# EAGLE design pico32_remote_v1_0 (EAGLE 9.6.2)
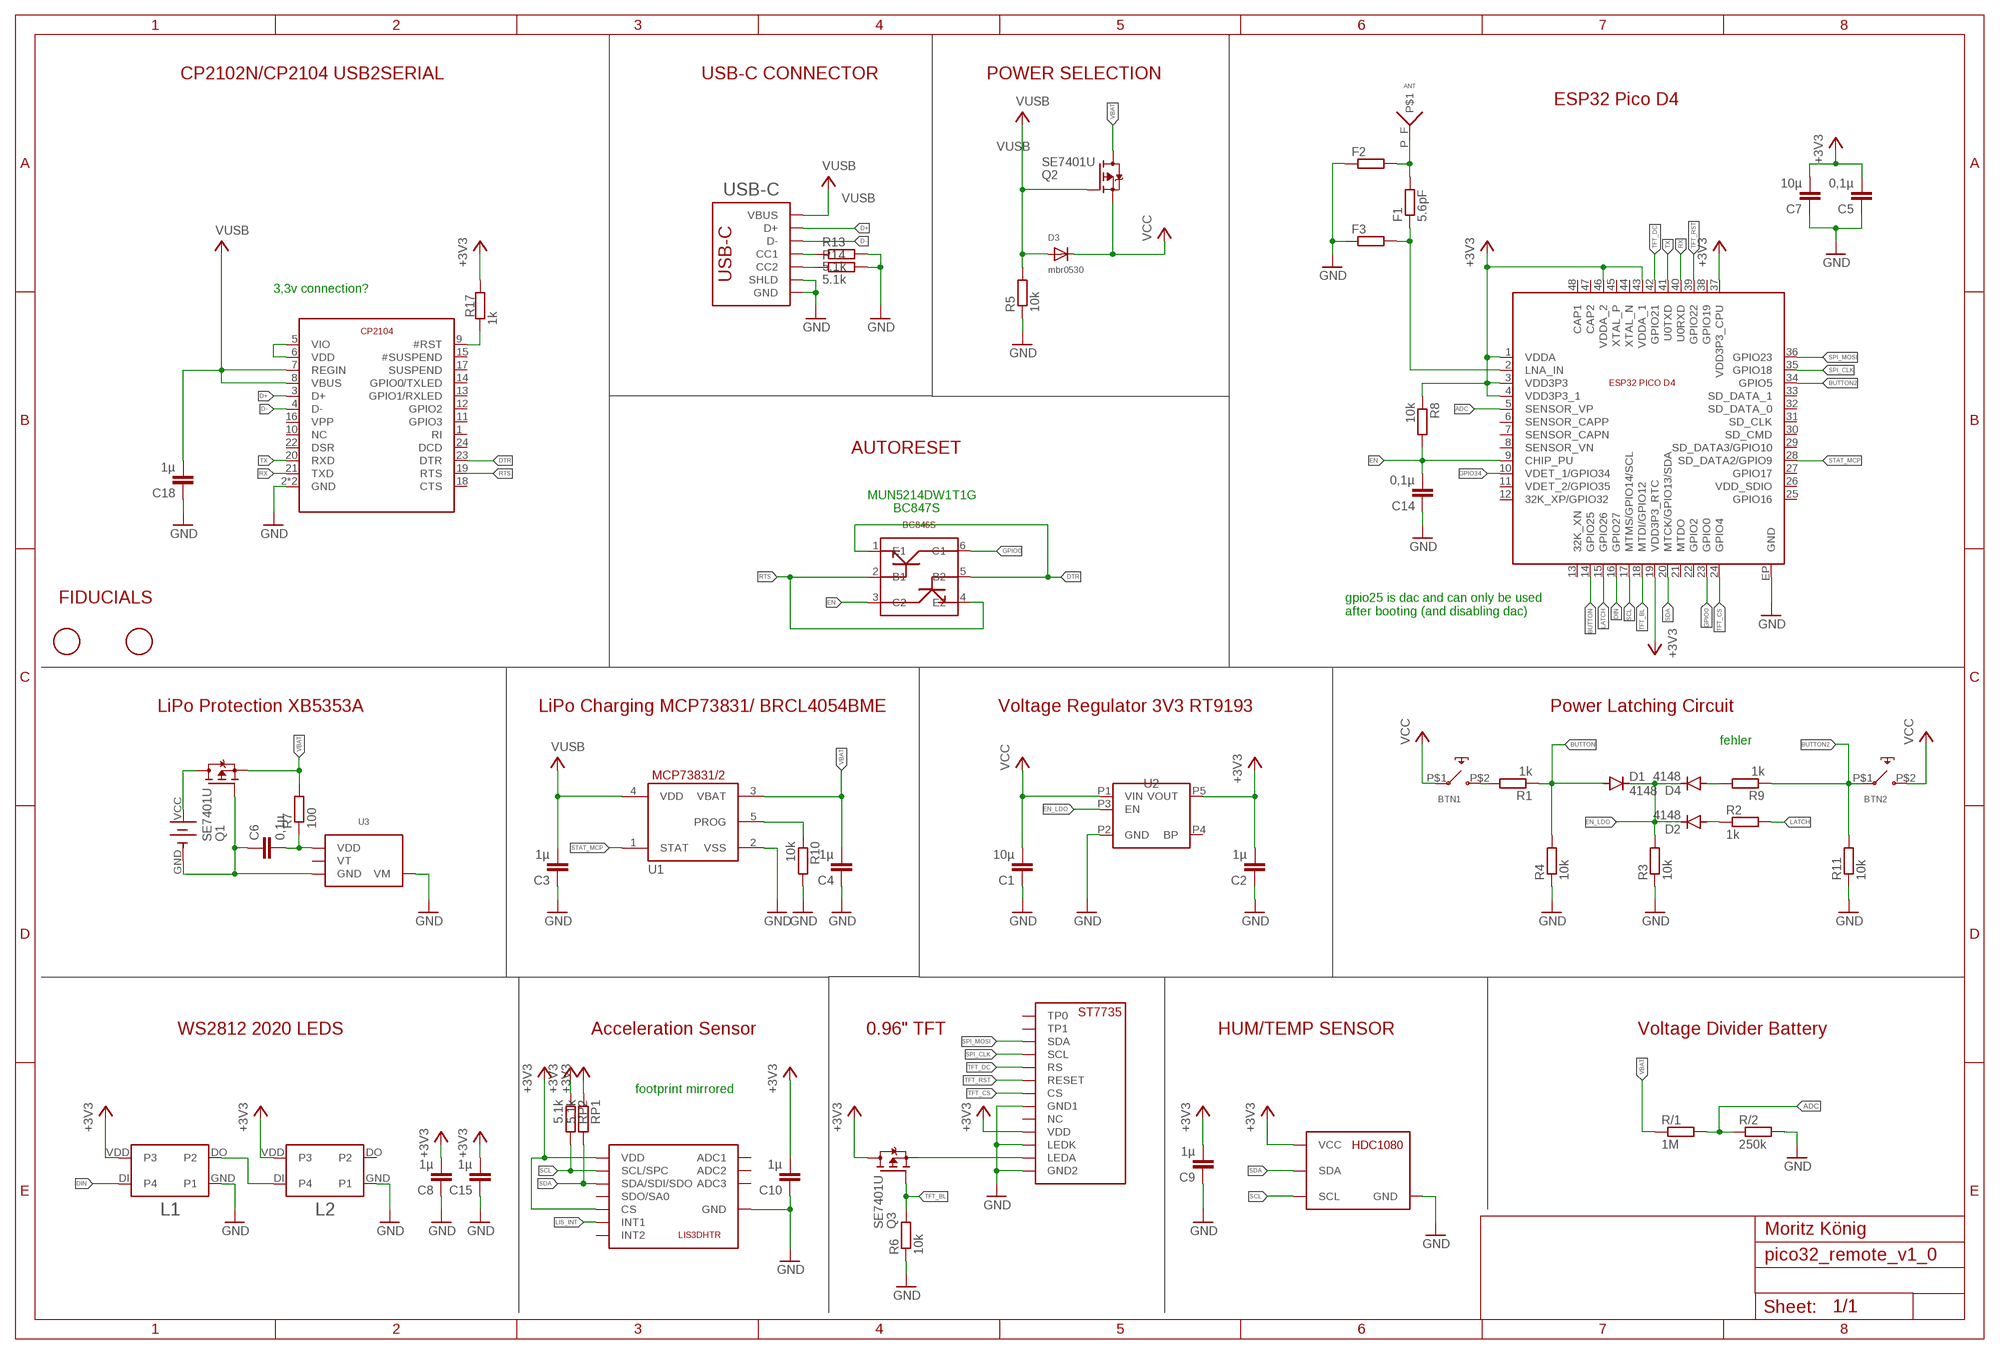
[diagram p0: schematic, sheet 1]

## Parts
ANT  MOLEX_ANT_3D  [MOLEX_ANT_3D]
BTN1  BUTTON_6X6_SILICON  [BUTTON_SILICON]
BTN2  BUTTON_6X6_SILICON  [BUTTON_SILICON]
C1  10µ  C-EU_WO_KEEPOUT  [C0603]
C2  1µ  C-EU_WO_KEEPOUT  [C0603]
C3  1µ  C-EU-0402-WOKEEPOUT_R  [R0402]
C4  1µ  C-EU-0402-WOKEEPOUT_R  [R0402]
C5  0,1µ  C-EU_WO_KEEPOUT  [C0603]
C6  0,1µ  C-EU-0402-WOKEEPOUT_R  [R0402]
C7  10µ  C-EU_WO_KEEPOUT  [C0603]
C8  1µ  C-EU-0402-WOKEEPOUT_R  [R0402]
C9  1µ  C-EU-0402-WOKEEPOUT_R  [R0402]
C10  1µ  C-EU-0402-WOKEEPOUT_R  [R0402]
C14  0,1µ  C-EUC0402K  [C0402K]
C15  1µ  C-EU-0402-WOKEEPOUT_R  [R0402]
C18  1µ  C-EU-0402-WOKEEPOUT_R  [R0402]
D1  4148  DIODE-SOD523  [SOD523]
D2  4148  DIODE-SOD523  [SOD523]
D3  mbr0530  DIODE_SOD-123FL  [SOD-123FL]
D4  4148  DIODE-SOD523  [SOD523]
ESP32  ESP32_PICO_D4_LP  [QFN-48_LONG]
F1  5.6pF  R-EU-0402-WOKEEPOUT  [R0402]
F2  R-EU-0402-WOKEEPOUT  [R0402]
F3  R-EU-0402-WOKEEPOUT  [R0402]
L1  WS2812_2020  [WS2812_2020]
L2  WS2812_2020  [WS2812_2020]
Q1  SE7401U  [SOT323]
Q2  SE7401U  [SOT323]
Q3  SE7401U  [SOT323]
R1  1k  R-EU-0402-WOKEEPOUT  [R0402]
R2  1k  R-EU-0402-WOKEEPOUT  [R0402]
R3  10k  R-EU-0402-WOKEEPOUT  [R0402]
R4  10k  R-EU-0402-WOKEEPOUT  [R0402]
R5  10k  R-EU-0402-WOKEEPOUT  [R0402]
R6  10k  R-EU-0402-WOKEEPOUT  [R0402]
R7  100  R-EU-0402-WOKEEPOUT  [R0402]
R8  10k  R-EU-0402-WOKEEPOUT  [R0402]
R9  1k  R-EU-0402-WOKEEPOUT  [R0402]
R10  10k  R-EU-0402-WOKEEPOUT  [R0402]
R11  10k  R-EU-0402-WOKEEPOUT  [R0402]
R13  5.1k  R-EU-0402-WOKEEPOUT  [R0402]
R14  5.1k  R-EU-0402-WOKEEPOUT  [R0402]
R17  1k  R-EU-0402-WOKEEPOUT  [R0402]
R/1  1M  R-EU-0402-WOKEEPOUT  [R0402]
R/2  250k  R-EU-0402-WOKEEPOUT  [R0402]
RP1  5.1k  R-EU-0402-WOKEEPOUT  [R0402]
RP2  5.1k  R-EU-0402-WOKEEPOUT  [R0402]
U1  BRCL4054BME  MCP73831/OT  [SOT23-5L]
U2  RT9193_SC70-5  [SC-70-5]
U3  XB5353A  [SOT23-5]
U4  LIS3DHTR  [LGA_16_LIS3DHTR]
U5  CP2102N  CP2104  [QFN24-4X4]
U6  MUN5214DW1T1G  BC846S  [SOT363]
U7  HDC1080  [WSON08_HDC1080]
U$2  2450_BATTERYHOLDER_SMD  [2450_BATTERYHOLDER_SMD]
U$4  ST7735_096TFT_TWISTED  [ST7735_096TFT_TWISTED]
U$6  FIDUCIAL  [FIDUCIAL_1MM]
U$7  FIDUCIAL  [FIDUCIAL_1MM]
USB-C  USB_C_C393939  [USBC_C393939]

## Nets
+3V3: C2.2 C5.2 C7.2 C8.2 C9.2 C10.2 C15.2 ESP32.1(VDDA) ESP32.3(VDD3P3) ESP32.4(VDD3P3_1) ESP32.19(VDD3P3_RTC) ESP32.37(VDD3P3_CPU) ESP32.43(VDDA_1) ESP32.46(VDDA_2) L1.VDD(P3) L2.VDD(P3) Q3.3(D) R8.1 R17.2 RP1.1 RP2.1 U2.P5(VOUT) U4.P$1(VDD) U4.P$8(CS) U4.P$14(VDD) U7.P5(VCC) U$4.P10(VDD)
ADC: ESP32.5(SENSOR_VP) R/1.2 R/2.1
ANTENNA1: ANT.P_F F1.2 F2.2
BUTTON: D1.A ESP32.14(GPIO25) R1.1 R4.2
BUTTON2: BTN2.P$1(P1) ESP32.34(GPIO5) R9.1 R11.2
D+: U5.3(D+) USB-C.A6(D+) USB-C.B6(D+)
D-: U5.4(D-) USB-C.A7(D-) USB-C.B7(D-)
DIN: ESP32.16(GPIO27) L1.DI(P4)
DTR: U5.23(DTR) U6.1(E1) U6.5(B2)
EN: C14.2 ESP32.9(CHIP_PU) R8.2 U6.3(C2)
EN_LDO: D1.C D2.C D4.C R3.2 U2.P3(EN)
GND: C1.1 C2.1 C3.1 C4.1 C5.1 C7.1 C8.1 C9.1 C10.1 C14.1 C15.1 C18.1 ESP32.EP(GND) F2.1 F3.1 L1.GND(P1) L2.GND(P1) R3.1 R4.1 R5.1 R6.1 R10.2 R11.1 R13.2 R14.2 R/2.2 U1.2(VSS) U2.P2(GND) U3.4(VM) U3.5(VM) U4.P$5(GND) U4.P$10(GND) U4.P$12(GND) U5.2(GND) U5.EXP(GND) U7.P2(GND) U$4.P8(GND1) U$4.P11(LEDK) U$4.P13(GND2) USB-C.A1B12(GND) USB-C.B1A12(GND) USB-C.S1(SHLD) USB-C.S2(SHLD) USB-C.S3(SHLD) USB-C.S4(SHLD)
GPIO0: ESP32.23(GPIO0) U6.6(C1)
GPIO34: ESP32.10(VDET_1/GPIO34)
LATCH: ESP32.15(GPIO26) R2.2
LIS_INT: U4.P$11(INT1)
N$1: U5.5(VIO) U5.6(VDD)
N$2: D4.A R9.2
N$3: Q3.2(S) U$4.P12(LEDA)
N$4: ESP32.2(LNA_IN) F1.1 F3.2
N$5: C6.2 R7.1 U3.3(VDD)
N$8: C6.1 Q1.1(G) U3.2(GND) U$2.GND
N$9: Q1.3(D) U$2.VCC
N$10: L1.DO(P2) L2.DI(P4)
N$14: BTN1.P$2(P2) R1.2
N$16: D2.A R2.1
N$18: R14.1 USB-C.B5(CC2)
N$23: R10.1 U1.5(PROG)
N$25: R13.1 USB-C.A5(CC1)
N$28: R17.1 U5.9(#RST)
RTS: U5.19(RTS) U6.2(B1) U6.4(E2)
RX: ESP32.40(U0RXD) U5.21(TXD)
SCL: ESP32.17(MTMS/GPIO14/SCL) RP2.2 U4.P$4(SCL/SPC) U7.P6(SCL)
SDA: ESP32.20(MTCK/GPIO13/SDA) RP1.2 U4.P$6(SDA/SDI/SDO) U7.P1(SDA)
SPI_CLK: ESP32.35(GPIO18) U$4.P4(SCL)
SPI_MOSI: ESP32.36(GPIO23) U$4.P3(SDA)
STAT_MCP: ESP32.28(SD_DATA2/GPIO9) U1.1(STAT)
TFT_BL: ESP32.18(MTDI/GPIO12) Q3.1(G) R6.2
TFT_CS: ESP32.24(GPIO4) U$4.P7(CS)
TFT_DC: ESP32.42(GPIO21) U$4.P5(RS)
TFT_RST: ESP32.39(GPIO22) U$4.P6(RESET)
TX: ESP32.41(U0TXD) U5.20(RXD)
VBAT: C4.2 Q1.2(S) Q2.3(D) R7.2 R/1.1 U1.3(VBAT)
VCC: BTN1.P$1(P1) BTN2.P$2(P2) C1.2 D3.C Q2.2(S) U2.P1(VIN)
VUSB: C3.2 C18.2 D3.A Q2.1(G) R5.2 U1.4(VDD) U5.7(REGIN) U5.8(VBUS) USB-C.A4B9(VBUS) USB-C.B4A9(VBUS)
Unconnected: ESP32.6(SENSOR_CAPP) ESP32.7(SENSOR_CAPN) ESP32.8(SENSOR_VN) ESP32.11(VDET_2/GPIO35) ESP32.12(32K_XP/GPIO32) ESP32.13(32K_XN) ESP32.21(MTDO) ESP32.22(GPIO2) ESP32.25(GPIO16) ESP32.26(VDD_SDIO) ESP32.27(GPIO17) ESP32.29(SD_DATA3/GPIO10) ESP32.30(SD_CMD) ESP32.31(SD_CLK) ESP32.32(SD_DATA_0) ESP32.33(SD_DATA_1) ESP32.38(GPIO19) ESP32.44(XTAL_N) ESP32.45(XTAL_P) ESP32.47(CAP2) ESP32.48(CAP1) L2.DO(P2) U2.P4(BP) U3.1(VT) U4.P$7(SDO/SA0) U4.P$9(INT2) U4.P$13(ADC3) U4.P$15(ADC2) U4.P$16(ADC1) U5.1(RI) U5.10(NC) U5.11(GPIO3) U5.12(GPIO2) U5.13(GPIO1/RXLED) U5.14(GPIO0/TXLED) U5.15(#SUSPEND) U5.16(VPP) U5.17(SUSPEND) U5.18(CTS) U5.22(DSR) U5.24(DCD) U$4.P1(TP0) U$4.P2(TP1) U$4.P9(NC)

## Notes on the sheet
- CP2102N/CP2104 USB2SERIAL | USB-C CONNECTOR | POWER SELECTION
- ESP32 Pico D4
- 3,3v connection?
- AUTORESET
- MUN5214DW1T1G
- BC847S
- FIDUCIALS
- gpio25 is dac and can only be used 
  after booting (and disabling dac)
- LiPo Protection XB5353A | LiPo Charging MCP73831/ BRCL4054BME | Voltage Regulator 3V3 RT9193 | Power Latching Circuit
- fehler
- WS2812 2020 LEDS | Acceleration Sensor | 0.96" TFT | HUM/TEMP SENSOR | Voltage Divider Battery
- footprint mirrored
- Moritz König

## Library data of the parts
ANT = moekoe:MOLEX_ANT_3D
BTN1 BTN2 = moekoe:BUTTON_6X6_SILICON
C1 C2 C5 C7 = moekoe:C-EU_WO_KEEPOUT
C3 C4 C6 C8-C10 C15 C18 = moekoe:C-EU-0402-WOKEEPOUT
C14 = rcl:C-EU: CAPACITOR, European symbol; SPICEPREFIX: C
D1 D2 D4 = diode:DIODE-: DIODE
D3 = adafruit:DIODE: Diode SMADIODE - SMA Surface Mount Package 20V 1A Schottky Diode Digikey: 641-1014-6-ND DO-1N4148 - Through Hole Small Current Diode SOD-123 20V 1 A (.5mV Vf) Schottky Diode - Digikey: MBRX120TPMSCT-ND SOD-323 10V 570mA (.38mV Vf, 3ns) Schottky Diode - Digikey: ZLLS410CT-ND SOD-523 30V 30mA Schottky Diode (RB751S-40TE61) - Digikey: RB751S-40TE61CT-ND SOT23-R/W - SOT23 Package (R = Solder Paste/Reflow Ovens, W = Hand-Soldering) BAT54Film 40V 300mA - Digikey: 497-7162-1-ND
ESP32 = moekoe:ESP32_PICO_D4
F1-F3 R1-R11 R13 R14 R17 R/1 R/2 RP1 RP2 = moekoe:R-EU-0402-WOKEEPOUT
L1 L2 = moekoe:WS2812_2020
Q1-Q3 = moekoe:SE7401U
U1 = adafruit:MCP73831: MCP73831/2 Miniature Single-Cell, Fully Integrated Li-Ion, Li-Polymer Charge Management Controllers. Nice and small simple lipoly charge controller, with adjustable current and status output (LED) http://www.ladyada.net/library/pcb/eaglelibrary.html
U2 = moekoe:RT9193_SC70-5
U3 = moekoe:XB5353A
U4 = moekoe:LIS3DHTR
U5 = moekoe:CP2104
U6 = moekoe:BC846S
U7 = moekoe:HDC1080
U$2 = moekoe:2450_BATTERYHOLDER_SMD
U$4 = moekoe:ST7735_096TFT
U$6 U$7 = adafruit:FIDUCIAL: For use by pick and place machines to calibrate the vision/machine, 1mm By microbuilder.eu
USB-C = moekoe:USB_C_C393939

## Board
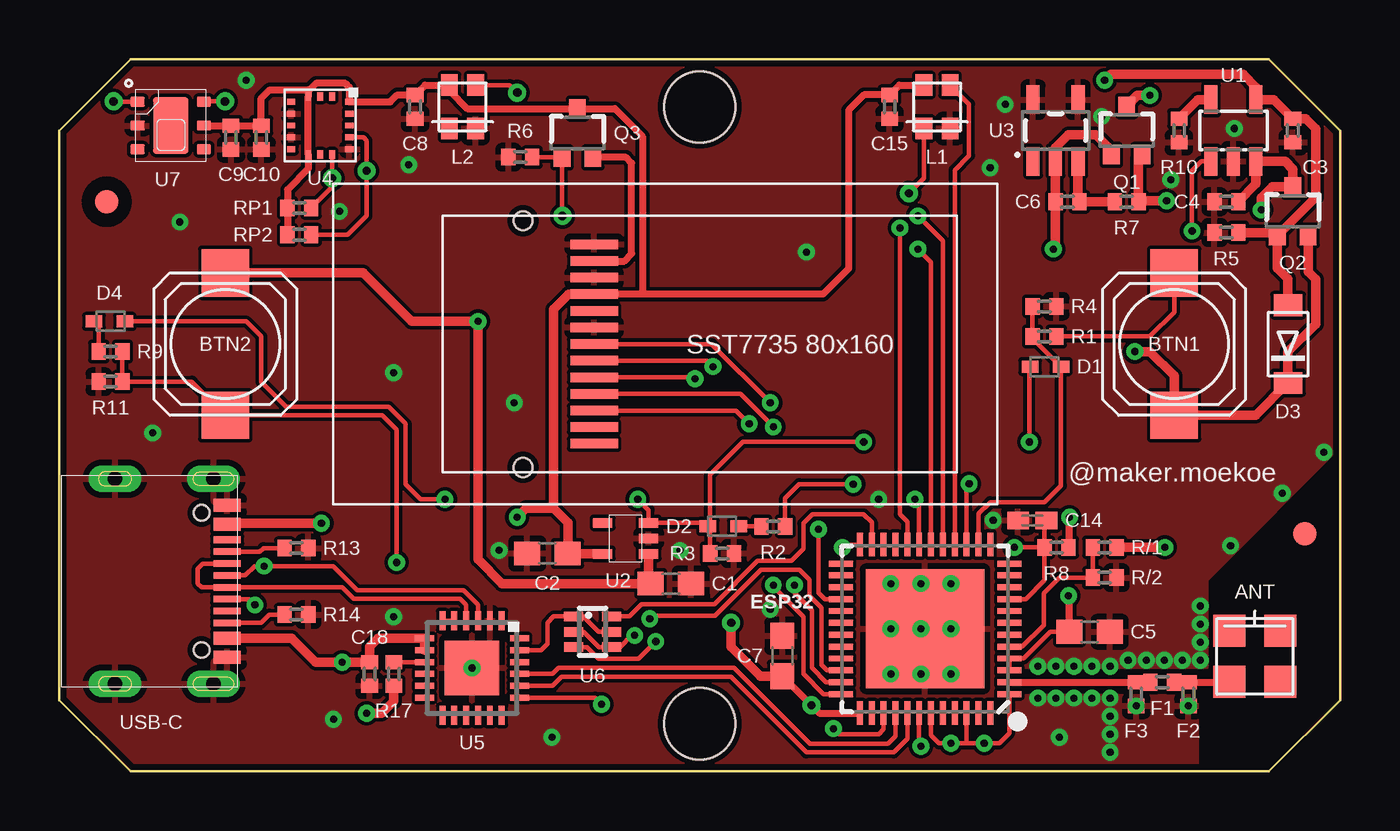
[diagram p1: board, top side]
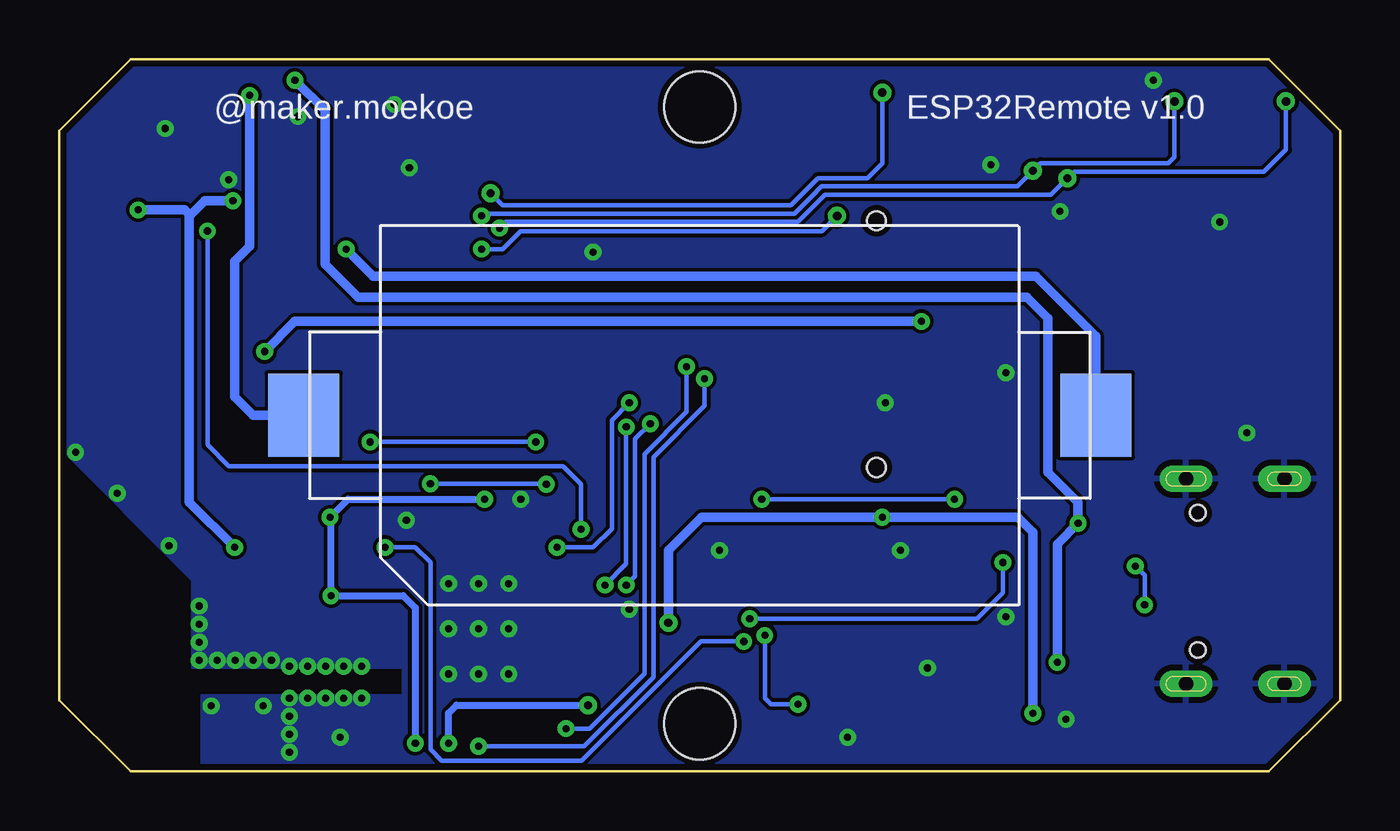
[diagram p2: board, bottom side, seen from below]

Size 54 x 30 mm. Coordinates in mm from the lower left corner, seen from the top.
Outline: 51,0 3,0 0,3 0,27 3,30 51,30 54,27 54,3 51,0
Copper layers (1*16): Top 0.035mm / dielectric 1.5mm / Bottom 0.035mm
Design rules "default *": minimum track width 6mil, minimum drill 0.3mm, track to track 6mil, track to pad 6mil, pad to pad 6mil, via to via 6mil, smd to smd 6mil, copper to edge 10mil, drill to drill 6mil, minimum pad ring 10mil, minimum via ring 8mil, stop-mask expansion 0mil, vias tented up to drill 0.5mm, thermal gap 10mil
Holes 3 mm at 27,28 27,2

### Footprints (pad centres in the part's own frame; a part is rotated, then mirrored left to right if it is on the bottom)
MOLEX_ANT_3D = smd 1.35 x 1.35: P$1 1.075,1.075; P$3 -1.075,-1.075; P$4 -1.075,1.075; P_F 1.075,-1.075
BUTTON_SILICON = smd 2 x 2: P$1 -3,0; P$2 3,0
C0603 = smd 1.1 x 1: 1 -0.85,0; 2 0.85,0
R0402 = smd 0.6 x 0.7: 1 -0.5,0; 2 0.5,0
C0402K = smd 0.925 x 0.74: 1 -0.6,0; 2 0.6,0
SOD523 = smd 0.7 x 0.5: A 0.7,0; C -0.6,0
SOD-123FL = smd 0.91 x 1.22: A 1.637,0; C -1.637,0
QFN-48_LONG = smd 1 x 0.25: 1 -3.55,2.75; 2 -3.55,2.25; 3 -3.55,1.75; 4 -3.55,1.25; 5 -3.55,0.75; 6 -3.55,0.25; 7 -3.55,-0.25; 8 -3.55,-0.75; 9 -3.55,-1.25; 10 -3.55,-1.75; 11 -3.55,-2.25; 12 -3.55,-2.75; 25 3.55,-2.75; 26 3.55,-2.25; 27 3.55,-1.75; 28 3.55,-1.25; 29 3.55,-0.75; 30 3.55,-0.25; 31 3.55,0.25; 32 3.55,0.75; 33 3.55,1.25; 34 3.55,1.75; 35 3.55,2.25; 36 3.55,2.75 | smd 0.25 x 1: 13 -2.75,-3.55; 14 -2.25,-3.55; 15 -1.75,-3.55; 16 -1.25,-3.55; 17 -0.75,-3.55; 18 -0.25,-3.55; 19 0.25,-3.55; 20 0.75,-3.55; 21 1.25,-3.55; 22 1.75,-3.55; 23 2.25,-3.55; 24 2.75,-3.55; 37 2.75,3.55; 38 2.25,3.55; 39 1.75,3.55; 40 1.25,3.55; 41 0.75,3.55; 42 0.25,3.55; 43 -0.25,3.55; 44 -0.75,3.55; 45 -1.25,3.55; 46 -1.75,3.55; 47 -2.25,3.55; 48 -2.75,3.55 | smd 5 x 5: EP 0,0
WS2812_2020 = smd 0.9 x 0.7: DI -0.915,0.55; DO 0.915,-0.55; GND 0.915,0.55; VDD -0.915,-0.55
SOT323 = smd 0.7 x 0.8: 1 -0.65,-1.025; 2 0.65,-1.025; 3 0,1.025
SOT23-5L = smd 0.55 x 1.2: 1 -0.95,-1.3; 2 0,-1.3; 3 0.95,-1.3; 4 0.95,1.3; 5 -0.95,1.3
SC-70-5 = smd 0.4 x 0.8: P1 0.65,0.97; P2 0,0.97; P3 -0.65,0.97; P4 -0.65,-0.97; P5 0.65,-0.97
SOT23-5 = smd 0.55 x 1.2: 1 -0.95,-1.3; 2 0,-1.3; 3 0.95,-1.3; 4 0.95,1.3; 5 -0.95,1.3
LGA_16_LIS3DHTR = smd 0.35 x 0.25: P$1 1.225,1; P$2 1.225,0.5; P$3 1.225,0; P$4 1.225,-0.5; P$5 1.225,-1; P$9 -1.225,-1; P$10 -1.225,-0.5; P$11 -1.225,0; P$12 -1.225,0.5; P$13 -1.225,1 | smd 0.25 x 0.35: P$6 0.5,-1.225; P$7 0,-1.225; P$8 -0.5,-1.225; P$14 -0.5,1.225; P$15 0,1.225; P$16 0.5,1.225
QFN24-4X4 = smd 0.8 x 0.25: 1 -2,1.25; 2 -2,0.75; 3 -2,0.25; 4 -2,-0.25; 5 -2,-0.75; 6 -2,-1.25; 13 2,-1.25; 14 2,-0.75; 15 2,-0.25; 16 2,0.25; 17 2,0.75; 18 2,1.25 | smd 0.25 x 0.8: 7 -1.25,-2; 8 -0.75,-2; 9 -0.25,-2; 10 0.25,-2; 11 0.75,-2; 12 1.25,-2; 19 1.25,2; 20 0.75,2; 21 0.25,2; 22 -0.25,2; 23 -0.75,2; 24 -1.25,2 | smd 2.3 x 2.3: EXP 0,0
SOT363 = smd 0.4 x 0.8: 1 -0.65,-0.8; 2 0,-0.8; 3 0.65,-0.8; 4 0.65,0.8; 5 0,0.8; 6 -0.65,0.8
WSON08_HDC1080 = smd 0.6 x 0.4: P1 -1.4,1; P2 -1.4,0; P3 -1.4,-1; P4 1.4,-1; P5 1.4,0; P6 1.4,1 | smd 1.5 x 2.4: P7 0,0
2450_BATTERYHOLDER_SMD = smd 3 x 3.5: GND 16.7,0; VCC -16.7,0
ST7735_096TFT_TWISTED = smd 2 x 0.4: P1 -4.45,-4.2; P2 -4.45,-3.5; P3 -4.45,-2.8; P4 -4.45,-2.1; P5 -4.45,-1.4; P6 -4.45,-0.7; P7 -4.45,0; P8 -4.45,0.7; P9 -4.45,1.4; P10 -4.45,2.1; P11 -4.45,2.8; P12 -4.45,3.5; P13 -4.45,4.2 | hole 0.8: -7.45,-5.2; -7.45,5.2
FIDUCIAL_1MM = smd 1 x 1: 1 0,0
USBC_C393939 = smd 0.55 x 1.15: A1B12 -3.2,0.575; A4B9 -2.4,0.575; B1A12 3.2,0.575; B4A9 2.4,0.575 | smd 0.275 x 1.15: A5 -1.25,0.575; A6 -0.25,0.575; A7 0.25,0.575; B5 1.75,0.575; B6 0.75,0.575; B7 -0.75,0.575; B8 1.25,0.575 | smd 0.3 x 1.15: A8 -1.75,0.575 | drill 0.6 pad 1 long: S1 -4.32,0; S2 4.32,0; S3 -4.32,-4.15; S4 4.32,-4.15 | hole 0.65: 2.89,-0.5; -2.89,-0.5

### Placement (x,y rotation side)
ANT  50.4,4.84 270 top
BTN1  47,18 90 top
BTN2  7,18 90 top
C1  25.78,7.91 180 top
C2  20.57,9.18 0 top
C3  52,27 90 top
C4  49.2,24 0 top
C5  43.44,5.87 180 top
C6  42.5,24 0 top
C7  30.48,4.86 270 top
C8  15,28 90 top
C9  7.24,26.7 90 top
C10  8.52,26.7 90 top
C14  41.02,10.57 0 top
C15  35,28 90 top
C18  13.08,4.1 90 top
D1  41.53,17.05 0 top
D2  27.94,10.32 0 top
D3  51.8,18 90 top
D4  2.16,18.95 180 top
ESP32  36.5,6 180 top
F1  46.5,3.75 0 top
F2  47.6,3.25 90 top
F3  45.4,3.25 90 top
L1  37,28 270 top
L2  17,28 270 top
Q1  45,27 0 top
Q2  52,23.6 0 top
Q3  21.84,26.89 0 top
R1  41.53,18.32 0 top
R2  30.1,10.32 0 top
R3  27.94,9.18 180 top
R4  41.53,19.59 180 top
R5  49.2,22.7 0 top
R6  19.43,25.88 0 top
R7  45,24 0 top
R8  42.04,9.43 180 top
R9  2.16,17.68 180 top
R10  47.2,27 270 top
R11  2.16,16.41 0 top
R13  10,9.4 0 top
R14  10,6.6 0 top
R17  14.1,4.1 270 top
R/1  44.07,9.43 180 top
R/2  44.07,8.16 0 top
RP1  10.12,23.74 0 top
RP2  10.12,22.61 0 top
U1  49.5,27 0 top
U2  23.88,9.81 270 top
U3  42,27 0 top
U4  11,27.21 0 top
U5  17.4,4.35 270 top
U6  22.48,5.87 270 top
U7  4.7,27.21 0 top
U$2  27,15 0 bottom
U$4  27,18 0 top
U$6  2,24 0 top
U$7  52.5,10 0 top
USB-C  6.5,8 270 top

### Tracks (layer width: path | path; a pad name or v marks a point on that pad's centre or on a via)
+3V3  (via drill 0.3, 0.35)
  Top 0.2: ESP32.43 36.75,1.51 37.09,1.17 v37.59,1.17 38.23,1.17 | 38.23,1.17 v38.99,1.17 39.62,1.17 40.05,1.6 ESP32.1 | ESP32.46 38.25,1.2 38.23,1.17 | C5.2 41.78,5.87 40.66,4.75 ESP32.4 ESP32.3 | ESP32.19 36.25,11.28 v36.07,11.46
  Top 0.3: U7.P5 C9.2 C10.2 8.52,28.36 8.87,28.71 10.5,28.71 | L1.VDD 35.41,28.91 C15.2 33.93,28.5 33.27,27.84 33.27,21.18 32.2,20.1 24.64,20.1 | R8.1 42.59,9.48 v42.59,10.7 | C5.2 42.59,7.36 v42.55,7.4 | RP2.1 RP1.1 9.62,24.51 10.5,25.39 U4.P$8 U4.P$14 10.5,28.71 | 10.5,28.71 10.55,28.71 10.82,28.99 12.07,28.99 12.23,28.83 U4.P$1 13.19,28.21 13.19,28.2 13.95,28.2 14.25,28.5 C8.2 15.41,28.91 L2.VDD 16.45,28.67 17.2,27.92 Q3.3 23.42,27.92 24.58,26.76 24.58,20.16 24.64,20.1 | 24.64,20.1 U$4.P10 | C7.2 v31.71,2.78 32.04,2.45 ESP32.37
  Top 0.4: U2.P5 21.44,9.16 | 21.44,9.16 C2.2 | 21.44,9.16 21.44,10.47 20.83,11.08 | U$4.P10 21.47,20.1 20.83,19.46 20.83,11.08 | 20.83,11.08 19.69,11.08 v19.3,10.7 | v12.95,2.45 13.59,2.45 14.1,2.95 R17.2 | v28.32,6.26 28.32,5.24 29.55,4.01 C7.2
  Bottom 0.3: v36.07,11.46 41.83,11.46 v42.59,10.7 42.55,10.66 v42.55,7.4 39.5,7.4 38.99,6.89 v38.99,1.17 | v37.59,1.17 37.59,2.45 37.26,2.78 v31.71,2.78
  Bottom 0.4: v12.95,2.45 12.95,10.06 13.59,10.7 v19.3,10.7 26.92,10.7 28.32,9.3 v28.32,6.26
ADC
  Top 0.2: ESP32.5 40.59,5.25 41.5,6.16 41.5,7.49 42.16,8.16 R/2.1 R/1.2
ANTENNA1
  Top 0.3: F1.2 F2.2 ANT.P_F
BUTTON
  Top 0.2: ESP32.14 38.75,10.84 39.24,11.34 41.53,11.34 42.23,12.04 D1.A 41.03,18.25 R1.1 R4.2
BUTTON2  (via drill 0.3)
  Top 0.2: R9.1 R11.2 5.59,16.41 BTN2.P$1 13.61,15 14.23,14.38 v14.23,8.79 | ESP32.34 32.36,4.25 32.13,4.48 32.13,6.89 31.62,7.4 31.62,8.06 31.2,8.49 29.58,8.49 27.64,6.55 25.02,6.55 v24.89,6.43
  Bottom 0.2: v24.89,6.43 15.32,6.43 14.23,7.53 v14.23,8.79
D+  (via drill 0.3)
  Top 0.2: U5.3 17.65,7.01 17.04,7.62 12.55,7.62 11.53,8.64 v8.64,8.64 8.23,8.64 7.84,8.25 USB-C.A6 | USB-C.B6 8,7.25 v8.25,7.01
  Bottom 0.2: v8.25,7.01 8.25,8.25 v8.64,8.64
D-
  Top 0.2: U5.4 17.15,7.01 16.89,7.27 12.41,7.27 11.92,7.76 7.09,7.76 USB-C.A7 6,7.75 5.84,7.91 5.84,8.54 6.05,8.75 USB-C.B7
DIN
  Top 0.2: ESP32.16 37.75,25.34 38.35,25.94 38.35,28.11 L1.DI
DTR
  Top 0.2: U6.5 22.73,5.87 22.08,6.52 U6.1 20.84,6.52 20.57,6.26 20.57,5.37 20.31,5.1 U5.23
EN  (via drill 0.3)
  Top 0.2: U6.3 22.24,5.22 22.48,4.99 22.49,4.99 22.74,4.74 24.41,4.74 v25.15,5.47 | ESP32.9 40.75,7.25 41.54,8.04 R8.2 | v40.26,9.43 R8.2 | C14.2 41.54,10.49 R8.2
  Bottom 0.2: v25.15,5.47 26.95,5.47 31.98,0.44 37.88,0.44 38.35,0.92 38.35,8.79 38.99,9.43 v40.26,9.43
EN_LDO  (via drill 0.3)
  Top 0.2: 27.44,10.22 D2.C 27.2,10.46 U2.P3 24.85,11 v24.38,11.46 | 27.44,10.22 R3.2 | D4.C 7.88,18.95 8.51,18.32 8.51,16.41 9.57,15.35 13.89,15.35 14.61,14.64 14.61,12.1 15.24,11.46 v16.26,11.46 | 27.44,10.22 27.44,12.49 28.83,13.88 v33.91,13.88 | v40.9,13.88 40.9,17.02 D1.C
  Bottom 0.2: v40.9,13.88 v33.91,13.88 | v24.38,11.46 v16.26,11.46
GND  (via drill 0.3)
  other vias: 39.88,28.1 43.94,27.59 39.24,25.43 31.5,21.88 14.73,25.56 7.88,29.11 5.08,23.15 3.94,14.26 19.18,15.53 14.1,16.8 34.55,11.46 18.54,9.3 11.56,2.19 42.16,1.43 36.32,6 49.53,27.08 46.86,24.92 51.56,11.72 39.37,10.57 14.1,6.51 17.4,4.35 26.16,9.3 20.77,1.43 41.25,4.42 42.01,4.42 42.77,4.42 43.54,4.42 44.3,4.42 41.25,3.08 42.01,3.08 42.77,3.08 43.54,3.08 44.3,3.08 45.06,4.67 45.82,4.67 46.58,4.67 47.35,4.67 48.11,4.67 44.3,2.32 44.3,1.56 44.3,0.79 48.11,5.44 48.11,6.2 48.11,6.96 49.38,9.5 53.31,13.44 45.4,2.75 47.6,2.75 36.32,7.91 35.05,7.91 35.05,6 35.05,4.1 36.32,4.1 37.59,4.1 37.59,6 37.59,7.91 11.81,23.59 29.97,6.83
  pour Top: -0.38,30.38 -0.38,-0.09 48.01,-0.09 48.01,3.21 39.5,3.21 39.5,4.35 48.39,4.35 48.39,8.03 54.23,13.88 54.23,30.38
  pour Bottom: -0.38,30.38 -0.38,-0.09 48.01,-0.09 48.01,3.21 39.5,3.21 39.5,4.35 48.39,4.35 48.39,8.03 54.23,13.88 54.23,30.38
GPIO0
  Top 0.2: ESP32.23 34.25,10.49 33.91,10.83 31.75,10.83 31.37,10.45 31.37,9.37 30.86,8.86 29.44,8.86 27.62,7.03 24.55,7.03 24.04,6.52 U6.6
LATCH  (via drill 0.3)
  Top 0.2: R2.2 30.6,11.51 31.19,12.1 v33.47,12.1 | ESP32.15 38.25,12.01 v38.36,12.12
  Bottom 0.2: v38.36,12.12 33.49,12.12 v33.47,12.1
N$1
  Top 0.2: U5.6 U5.5
N$2
  Top 0.2: D4.A 1.66,18.75 R9.2
N$3
  Top 0.3: U$4.P12 23.82,21.5 24.13,21.81 24.13,25.62 23.89,25.87 Q3.2
N$4
  Top 0.3: ESP32.2 F3.2 F1.1
N$5
  Top 0.4: U3.3 42.95,24.05 C6.2 R7.1
N$8  (via drill 0.3)
  Top 0.4: Q1.1 44.35,26.17 43.69,26.83 42.55,26.83 42,26.28 U3.2 C6.1 42,22.09 v41.91,22
  Bottom 0.4: U$2.GND 10.3,18.33 12.83,20.86 40.77,20.86 v41.91,22
N$9  (via drill 0.3)
  Top 0.4: v45.98,28.48 45.45,28.48 Q1.3
  Bottom 0.4: U$2.VCC 45.83,15 46.61,15.78 46.61,21.5 45.98,22.13 v45.98,28.48
N$10  (via drill 0.35)
  Top 0.2: L2.DI 18.99,28.91 v19.3,28.6 | v35.81,24.35 36.45,24.99 L1.DO
  Bottom 0.2: v19.3,28.6 19.3,25.62 19.93,24.99 22.02,24.99 23.16,23.85 35.31,23.85 v35.81,24.35
N$14
  Top 0.2: R1.2 45.98,18.32 47,19.34 BTN1.P$2
N$16
  Top 0.2: D2.A R2.1
N$18
  Top 0.2: USB-C.B5 8.5,6.25 8.86,6.6 R14.1
N$23
  Top 0.4: R10.1 48,28.3 U1.5
N$25
  Top 0.2: USB-C.A5 8.46,9.25 8.61,9.4 R13.1
N$28
  Top 0.2: R17.1 U5.9
RTS  (via drill 0.3)
  Top 0.2: U5.19 22.59,3.1 v22.86,2.83 | v24.26,5.72 24.13,5.72 23.63,5.22 U6.4 22.75,5.22 22.1,5.87 U6.2
  Bottom 0.2: v22.86,2.83 24,2.83 24.26,3.08 v24.26,5.72
RX
  Top 0.2: U5.21 20.8,4.1 21.05,4.35 28.44,4.35 31.64,1.15 34.93,1.15 35.25,1.47 ESP32.40
SCL  (via drill 0.3, 0.35)
  Top 0.2: ESP32.17 37.25,22.35 v36.2,23.4 | RP2.2 12.16,22.61 12.95,23.4 v12.95,25.3 12.95,26.57 12.82,26.71 U4.P$4 | v6.99,28.23 6.12,28.23 U7.P6
  Bottom 0.2: v36.2,23.4 36.1,23.5 23.02,23.5 22.28,24.24 22.27,24.24 21.86,24.64 13.62,24.64 v12.95,25.3 12.64,25.62 7.24,25.62 6.99,25.88 v6.99,28.23
SDA  (via drill 0.3, 0.35)
  Top 0.2: ESP32.20 35.75,10.51 35.43,10.83 v35.43,22.89 | RP1.2 11.5,24.62 v11.5,24.99 U4.P$6 | v2.29,28.23 2.3,28.21 U7.P1
  Bottom 0.2: v35.43,22.89 35.18,23.15 22.86,23.15 21.72,24.29 12.2,24.29 v11.5,24.99 11.22,25.27 3.21,25.27 2.29,26.19 v2.29,28.23
SPI_CLK  (via drill 0.3)
  Top 0.2: U$4.P4 28.71,15.9 v30.1,14.51 | v30.99,7.84 30.99,7.53 31.72,6.79 31.72,4.35 32.32,3.75 ESP32.35
  Bottom 0.2: v30.1,14.51 30.1,8.73 v30.99,7.84
SPI_MOSI  (via drill 0.3)
  Top 0.2: ESP32.36 32.22,3.25 31.37,4.1 31.37,6.51 30.1,7.78 v30.1,7.84 | v29.08,14.64 28.52,15.2 U$4.P3
  Bottom 0.2: v30.1,7.84 29.72,8.22 29.72,14 v29.08,14.64
STAT_MCP  (via drill 0.3)
  Top 0.2: ESP32.28 32.28,7.25 32.01,7.53 v32.01,10.19 | v47.75,22.77 47.75,25.3 48.15,25.7 U1.1
  Bottom 0.2: v47.75,22.77 47.75,13.75 46.86,12.86 32.77,12.86 32.01,12.1 v32.01,10.19
TFT_BL  (via drill 0.3, 0.35)
  Top 0.2: ESP32.18 36.75,21.45 v36.2,22 | R6.2 19.94,25.87 Q3.1 21.2,23.41 v21.21,23.4
  Bottom 0.2: v36.2,22 35.31,22 34.55,22.77 21.84,22.77 v21.21,23.4
TFT_CS  (via drill 0.3)
  Top 0.2: ESP32.24 33.14,9.55 v33.02,9.43 | v29.97,15.53 27.5,18 U$4.P7
  Bottom 0.2: v33.02,9.43 31.5,9.43 30.71,10.22 30.71,14.79 v29.97,15.53
TFT_DC  (via drill 0.3)
  Top 0.2: U$4.P5 26.74,16.6 v26.8,16.54 | v36.32,1.05 36.25,1.12 ESP32.42
  Bottom 0.2: v26.8,16.54 26.8,15.4 28.96,13.24 28.96,3.97 31.88,1.05 v36.32,1.05
TFT_RST  (via drill 0.3)
  Top 0.2: U$4.P6 27.31,17.3 v27.56,17.05 | v32.64,1.79 32.88,1.56 34.55,1.56 34.75,1.76 ESP32.39
  Bottom 0.2: v27.56,17.05 27.56,15.14 29.34,13.37 29.34,4.1 31.64,1.79 v32.64,1.79
TX
  Top 0.2: U5.20 20.8,3.6 21.18,3.98 28.31,3.98 31.5,0.79 35.18,0.79 35.75,1.36 ESP32.41
VBAT  (via drill 0.3)
  Top 0.4: Q1.2 45.5,25.82 R7.2 45.53,24.04 v46.68,24.04 | C4.2 50.45,24.75 U1.3 51.68,25.7 52,25.38 Q2.3 51.14,24.62 50.67,24.16 v50.67,23.65 | v46.61,9.43 R/1.1
  Bottom 0.4: v46.68,24.04 47.88,24.04 48.48,23.43 48.71,23.65 v50.67,23.65 | v46.61,9.43 48.52,11.34 48.52,23.4
VCC  (via drill 0.3)
  Top 0.4: U2.P1 24.85,7.99 C1.2 18.67,7.91 17.65,8.92 v17.65,18.95 14.86,18.95 12.82,21 BTN2.P$2 | Q2.2 52.65,21.04 52.96,20.73 52.96,18.83 51.8,17.67 D3.C 50.44,15 BTN1.P$1 47,16.66 45.98,17.68 v45.34,17.68
  Bottom 0.4: v17.65,18.95 44.07,18.95 v45.34,17.68
VUSB  (via drill 0.3)
  Top 0.4: U5.8 U5.7 13.44,5.6 13.08,5.24 C18.2 v11.93,4.6 10.8,4.6 9.8,5.6 USB-C.B4A9 | v44.07,29.11 44.32,29.37 49.91,29.37 50.45,28.83 U1.4 51.2,28.3 C3.2 52.54,27.5 52.96,27.08 52.96,24.18 Q2.1 | v11.05,10.45 7.12,10.45 USB-C.A4B9 | R5.2 51.23,22.7 Q2.1 | Q2.1 51.35,21.2 51.8,20.75 D3.A
  Bottom 0.4: v44.07,29.11 42.8,27.84 42.8,21.37 41.4,19.97 13.21,19.97 12.32,19.08 12.32,12.61 11.05,11.34 v11.05,10.45 11.93,9.56 v11.93,4.6

### Text on the board
tPlace: @maker.moekoe
bPlace: ESP32Remote v1.0 | @maker.moekoe